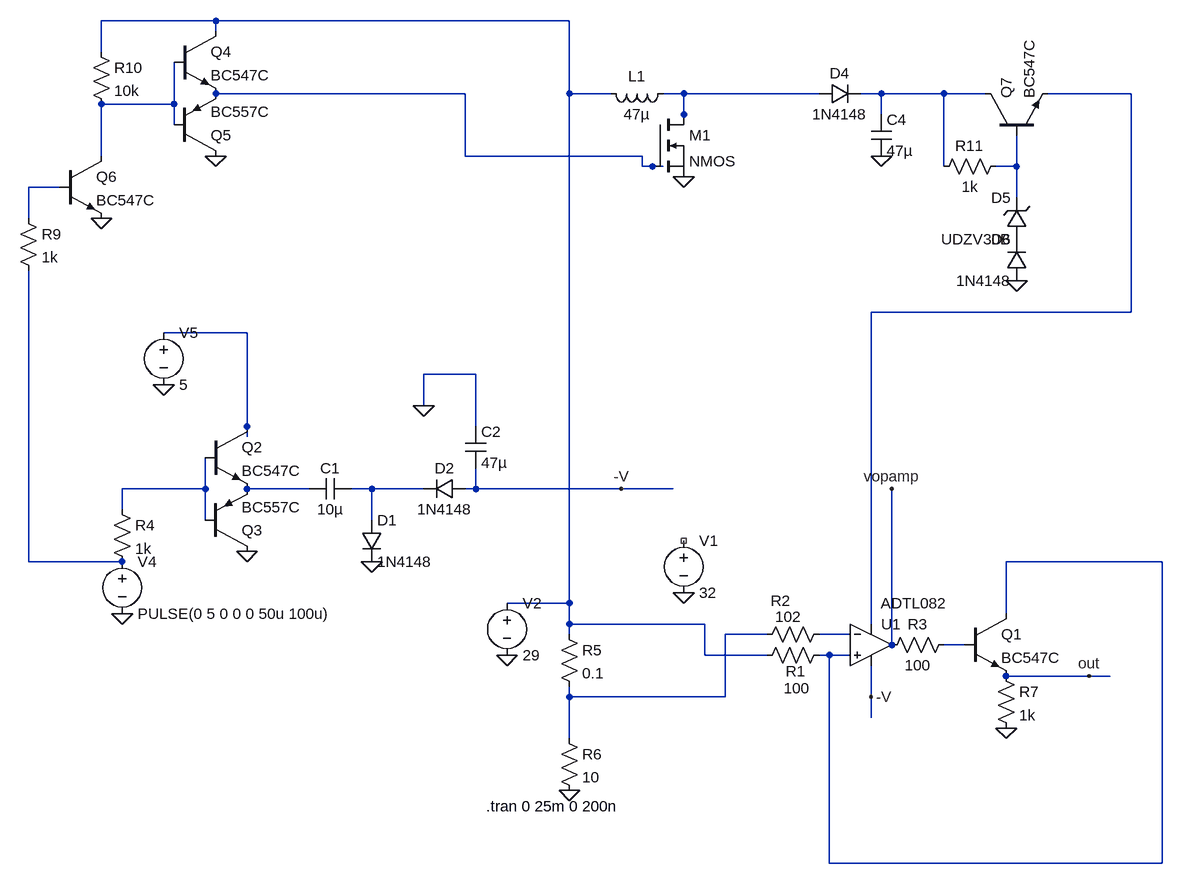
[diagram p0: schematic diff_opamp.asc]
diff_opamp.asc, the LTspice schematic file:
Version 4
SHEET 1 880 680
WIRE -752 -800 -928 -800
WIRE -208 -800 -752 -800
WIRE -752 -784 -752 -800
WIRE -928 -752 -928 -800
WIRE -368 -688 -752 -688
WIRE -208 -688 -208 -800
WIRE -144 -688 -208 -688
WIRE -32 -688 -64 -688
WIRE 176 -688 -32 -688
WIRE 272 -688 240 -688
WIRE 368 -688 272 -688
WIRE 432 -688 368 -688
WIRE 656 -688 528 -688
WIRE -816 -672 -816 -736
WIRE -816 -672 -928 -672
WIRE -32 -656 -32 -688
WIRE 272 -656 272 -688
WIRE -816 -640 -816 -672
WIRE -32 -640 -32 -656
WIRE -928 -592 -928 -672
WIRE -368 -592 -368 -688
WIRE -96 -592 -368 -592
WIRE -96 -576 -96 -592
WIRE -80 -576 -96 -576
WIRE -64 -576 -80 -576
WIRE 368 -576 368 -688
WIRE 480 -576 480 -624
WIRE 480 -576 448 -576
WIRE -992 -544 -1040 -544
WIRE 480 -528 480 -576
WIRE -1040 -496 -1040 -544
WIRE 656 -352 656 -688
WIRE 656 -352 256 -352
WIRE -704 -320 -832 -320
WIRE -352 -256 -432 -256
WIRE -432 -208 -432 -256
WIRE -704 -176 -704 -320
WIRE -352 -176 -352 -256
WIRE -704 -160 -704 -176
WIRE -768 -80 -768 -128
WIRE -768 -80 -896 -80
WIRE -608 -80 -704 -80
WIRE -512 -80 -544 -80
WIRE -432 -80 -512 -80
WIRE -352 -80 -352 -112
WIRE -352 -80 -368 -80
WIRE -128 -80 -352 -80
WIRE -48 -80 -128 -80
WIRE -896 -48 -896 -80
WIRE -768 -32 -768 -80
WIRE -512 -32 -512 -80
WIRE -1040 32 -1040 -416
WIRE -896 32 -1040 32
WIRE 704 32 464 32
WIRE -208 96 -208 -688
WIRE -208 96 -304 96
WIRE 464 112 464 32
WIRE -208 128 -208 96
WIRE 0 128 -208 128
WIRE 256 128 256 -352
WIRE -208 144 -208 128
WIRE 96 144 32 144
WIRE 224 144 176 144
WIRE 288 160 288 -80
WIRE 400 160 368 160
WIRE 0 176 0 128
WIRE 96 176 0 176
WIRE 192 176 176 176
WIRE 224 176 192 176
WIRE 592 208 464 208
WIRE 624 208 592 208
WIRE -208 240 -208 224
WIRE 32 240 32 144
WIRE 32 240 -208 240
WIRE 256 240 256 192
WIRE 256 272 256 240
WIRE -208 304 -208 240
WIRE 192 496 192 176
WIRE 704 496 704 32
WIRE 704 496 192 496
FLAG -32 80 0
FLAG -304 176 0
FLAG -208 384 0
FLAG 464 288 0
FLAG 592 208 out
FLAG 288 -80 vopamp
FLAG -896 112 0
FLAG -832 -240 0
FLAG -512 32 0
FLAG -704 16 0
FLAG -432 -208 0
FLAG -128 -80 -V
FLAG 256 240 -V
FLAG -752 -592 0
FLAG 272 -592 0
FLAG -928 -496 0
FLAG 480 -400 0
FLAG -32 -560 0
SYMBOL OpAmps\\ADTL082 256 96 R0
WINDOW 3 15 0 Left 2
SYMATTR InstName U1
SYMBOL res 192 160 R90
WINDOW 0 56 52 VBottom 2
WINDOW 3 51 50 VTop 2
SYMATTR InstName R1
SYMATTR Value 100
SYMATTR SpiceLine tol=5
SYMBOL res 80 160 R270
WINDOW 0 52 37 VTop 2
WINDOW 3 59 49 VBottom 2
SYMATTR InstName R2
SYMATTR Value 102
SYMATTR SpiceLine tol=5
SYMBOL voltage -32 -16 R0
WINDOW 123 0 0 Left 0
WINDOW 39 0 0 Left 0
SYMATTR InstName V1
SYMATTR Value 32
SYMBOL res -224 128 R0
SYMATTR InstName R5
SYMATTR Value 0.1
SYMBOL voltage -304 80 R0
WINDOW 123 0 0 Left 0
WINDOW 39 0 0 Left 0
SYMATTR InstName V2
SYMATTR Value 29
SYMBOL res -224 288 R0
SYMATTR InstName R6
SYMATTR Value 10
SYMBOL res 448 192 R0
SYMATTR InstName R7
SYMATTR Value 1k
SYMBOL res 384 144 R90
WINDOW 0 0 56 VBottom 2
WINDOW 3 32 56 VTop 2
SYMATTR InstName R3
SYMATTR Value 100
SYMBOL npn 400 112 R0
SYMATTR InstName Q1
SYMATTR Value BC547C
SYMBOL voltage -896 16 R0
WINDOW 123 0 0 Left 0
WINDOW 39 0 0 Left 0
SYMATTR InstName V4
SYMATTR Value PULSE(0 5 0 0 0 50u 100u)
SYMBOL npn -768 -176 R0
SYMATTR InstName Q2
SYMATTR Value BC547C
SYMBOL res -912 -64 R0
SYMATTR InstName R4
SYMATTR Value 1k
SYMBOL cap -544 -96 R90
WINDOW 0 0 32 VBottom 2
WINDOW 3 32 32 VTop 2
SYMATTR InstName C1
SYMATTR Value 10µ
SYMBOL pnp -768 16 M180
SYMATTR InstName Q3
SYMATTR Value BC557C
SYMBOL voltage -832 -336 R0
WINDOW 123 0 0 Left 0
WINDOW 39 0 0 Left 0
SYMATTR InstName V5
SYMATTR Value 5
SYMBOL diode -528 -32 R0
SYMATTR InstName D1
SYMATTR Value 1N4148
SYMBOL diode -368 -96 R90
WINDOW 0 0 32 VBottom 2
WINDOW 3 32 32 VTop 2
SYMATTR InstName D2
SYMATTR Value 1N4148
SYMBOL cap -368 -176 R0
SYMATTR InstName C2
SYMATTR Value 47µ
SYMBOL npn -816 -784 R0
SYMATTR InstName Q4
SYMATTR Value BC547C
SYMBOL pnp -816 -592 M180
SYMATTR InstName Q5
SYMATTR Value BC557C
SYMBOL diode 176 -672 R270
WINDOW 0 32 32 VTop 2
WINDOW 3 0 32 VBottom 2
SYMATTR InstName D4
SYMATTR Value 1N4148
SYMBOL cap 256 -656 R0
SYMATTR InstName C4
SYMATTR Value 47µ
SYMBOL res -1056 -512 R0
SYMATTR InstName R9
SYMATTR Value 1k
SYMBOL res -944 -768 R0
SYMATTR InstName R10
SYMATTR Value 10k
SYMBOL npn -992 -592 R0
SYMATTR InstName Q6
SYMATTR Value BC547C
SYMBOL npn 432 -624 R270
SYMATTR InstName Q7
SYMATTR Value BC547C
SYMBOL zener 496 -464 R180
WINDOW 0 24 64 Left 2
WINDOW 3 24 0 Left 2
SYMATTR InstName D5
SYMATTR Value UDZV30B
SYMATTR Description Diode
SYMATTR Type diode
SYMBOL diode 496 -400 R180
WINDOW 0 24 64 Left 2
WINDOW 3 24 0 Left 2
SYMATTR InstName D6
SYMATTR Value 1N4148
SYMBOL res 464 -592 R90
WINDOW 0 0 56 VBottom 2
WINDOW 3 32 56 VTop 2
SYMATTR InstName R11
SYMATTR Value 1k
SYMBOL ind -48 -704 R90
WINDOW 0 5 56 VBottom 2
WINDOW 3 32 56 VTop 2
SYMATTR InstName L1
SYMATTR Value 47µ
SYMBOL nmos -80 -656 R0
SYMATTR InstName M1
TEXT -336 408 Left 2 !.tran 0 25m 0 200n

The netlist it stands for:
* diff_opamp.asc
XU1 N014 N016 N005 -V vopamp ADTL082  ; pins In+ In- V+ V- OUT
R1 N014 N001 100 tol=5
R2 N015 N016 102 tol=5
V1 NC_01 0 32
R5 N001 N015 0.1
V2 N001 0 29
R6 N015 0 10
R7 out 0 1k
R3 N017 vopamp 100
Q1 N014 N017 out 0 BC547C
V4 N013 0 PULSE(0 5 0 0 0 50u 100u)
Q2 N009 N010 N011 0 BC547C
R4 N010 N013 1k
C1 N012 N011 10µ
Q3 0 N010 N011 0 BC557C
V5 N009 0 5
D1 N012 0 1N4148
D2 -V N012 1N4148
C2 0 -V 47µ
Q4 N001 N006 N002 0 BC547C
Q5 0 N006 N002 0 BC557C
D4 N003 N004 1N4148
C4 N004 0 47µ
R9 N008 N013 1k
R10 N001 N006 10k
Q6 N006 N008 0 0 BC547C
Q7 N004 N007 N005 0 BC547C
D5 P001 N007 UDZV30B
D6 0 P001 1N4148
R11 N007 N004 1k
L1 N003 N001 47µ
M1 N003 N002 0 0 NMOS
.model D D
.lib standard.dio
.model NPN NPN
.model PNP PNP
.lib standard.bjt
.model NMOS NMOS
.model PMOS PMOS
.lib standard.mos
.tran 0 25m 0 200n
.lib ADI.lib
.backanno
.end